# Altium schematic sheet FSR.SCHDOC: LiveDesign Evaluation - Video Games
size A; Organization: Altium Limited; Address1: L3, 12a Rodborough Rd; Address2: Frenchs Forest; Address3: NSW; Address4: Australia 2086; DocumentNumber: 8; SheetNumber: 8; SheetTotal: 13
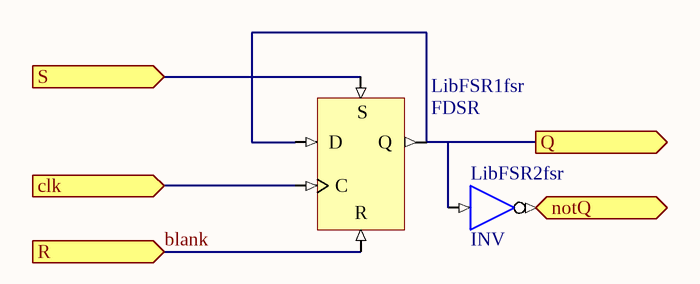
[diagram p0: FSR.SCHDOC]

## Parts
LibFSR1fsr  FDSR
LibFSR2fsr  INV

## Ports
clk (in), notQ (out), Q (out), R (in), S (in)

## Nets
blank: LibFSR1fsr.R ; port R
clk: LibFSR1fsr.C ; port clk
notQ: LibFSR2fsr.O ; port notQ
Q: LibFSR1fsr.D LibFSR1fsr.Q LibFSR2fsr.I ; port Q
S: LibFSR1fsr.S ; port S

## Notes on the sheet
- Title
- Size:
- Date:
- A
- Number:
- Time:
- Revision:
- Sheet
- of
- File:

## Library data of the parts
LibFSR1fsr = FDSR: D-Type Flip-Flop with Synchronous Set and Reset; ArchiveName: GENERIC; Published: 18-Dec-2003; Publisher: Altium Limited; Xilinx Equivalent: FDSR; Core Revision: 1.00.00
LibFSR2fsr = INV: Inverter; ArchiveName: GENERIC; Published: 7-Nov-2003; Publisher: Altium Limited; Xilinx Equivalent: INV; Core Revision: 1.00.00